# EAGLE design Pro-Mini-ICSP-FTDI (EAGLE 7.7.0)
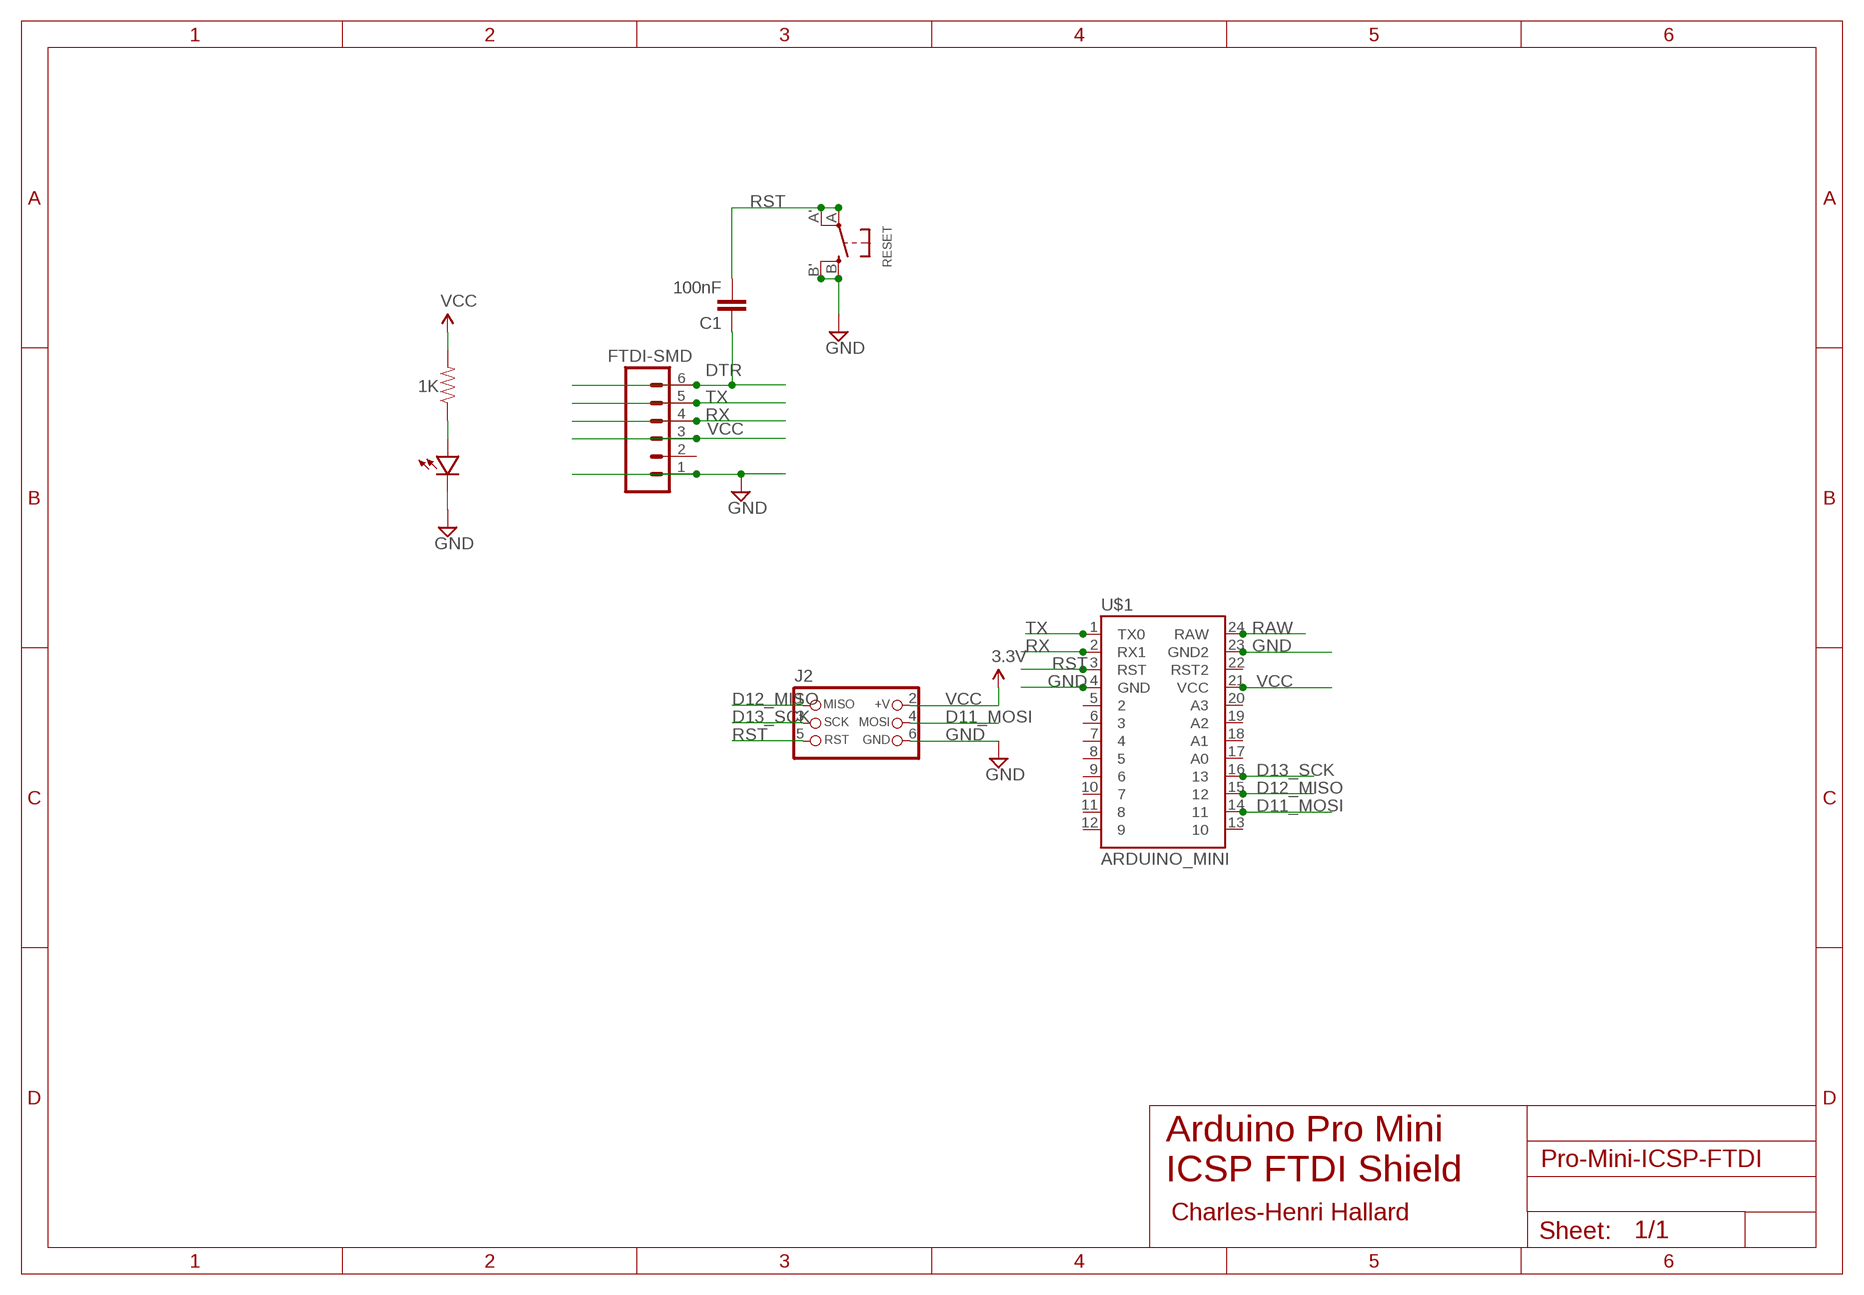
[diagram p0: schematic, sheet 1]

## Parts
C1  100nF  CAP0805-CAP  [0805-CAP]
FTDI-SMD  SMD  M06SIP  [1X06]
J2  CON_HEADER_PRG_AVR_ICSP-PTH  [HEADER_PRG_2X03]
R1  1K  RESISTOR0805-RES  [0805-RES]
RESET  SWITCH_TACT_SMT  [EVQ-Q2]
U$1  ARDUINO_MINI  [ARDUINO_MINI]
U$2  LED0805  [0805-LED]

## Nets
D11_MOSI: J2.4(MOSI) U$1.14
D12_MISO: J2.1(MISO) U$1.15
D13_SCK: J2.3(SCK) U$1.16
DTR: C1.1 FTDI-SMD.6
GND [power]: FTDI-SMD.1 J2.6(GND) RESET.B'(S1) RESET.B(S) U$1.4(GND) U$1.23(GND2) U$2.MINUS
N$2: R1.1 U$2.PLUS
RAW: U$1.24(RAW)
RST: C1.2 J2.5(RST) RESET.A'(P1) RESET.A(P) U$1.3(RST)
RX: FTDI-SMD.4 U$1.2(RX1)
TX: FTDI-SMD.5 U$1.1(TX0)
VCC: FTDI-SMD.3 J2.2(+V) R1.2 U$1.21(VCC) ; supply symbol labelled 3.3V
Unconnected: FTDI-SMD.2 U$1.5 U$1.6 U$1.7 U$1.8 U$1.9 U$1.10 U$1.11 U$1.12 U$1.13 U$1.17(A0) U$1.18(A1) U$1.19(A2) U$1.20(A3) U$1.22(RST2)

## Notes on the sheet
- Arduino Pro Mini
  ICSP FTDI Shield
- Charles-Henri Hallard

## Library data of the parts
C1 = _c2h:CAP: Capacitor Standard 0603 ceramic capacitor, and 0.1" leaded capacitor.
FTDI-SMD = SparkFun-Connectors:M06: Header 6 Standard 6-pin 0.1" header. Use with straight break away headers (SKU : PRT-00116), right angle break away headers (PRT-00553), swiss pins (PRT-00743), machine pins (PRT-00117), and female headers (PRT-00115). Molex polarized connector foot print use with SKU : PRT-08094 with associated crimp pins and housings. NOTES ON THE VARIANTS LOCK and LOCK_LONGPADS... This footprint was designed to help hold the alignment of a through-hole component (i.e. 6-pin header) while soldering it into place. You may notice that each hole has been shifted either up or down by 0.005 of an inch from it's more standard position (which is a perfectly straight line). This slight alteration caused the pins (the squares in the middle) to touch the edges of the holes. Because they are alternating, it causes a "brace" to hold the component in place. 0.005 has proven to be the perfect amount of "off-center" position when using our standard breakaway headers. Although looks a little odd when you look at the bare footprint, once you have a header in there, the alteration is very hard to notice. Also, if you push a header all the way into place, it is covered up entirely on the bottom side. This idea of altering the position of holes to aid alignment will be further integrated into the Sparkfun Library for other footprints. It can help hold any component with 3 or more connection pins.
J2 = dp_devices:CON_HEADER_PRG_AVR_ICSP: 2x3 AVR ICSP programming header
R1 = _c2h:RESISTOR: Resistor Basic schematic elements and footprints for 0603, 1206, and PTH resistors.
RESET = microbuilder:SWITCH_TACT_SMT: SMT Tact Switches 6x6mm - Digikey: P12940SCT-ND KMR2 (4.6x2.8mm) - Digikey: 401-1426-1-ND EVQ-PQHB55 - Light Touch, 160GF (4.5x4.5mm) - Digikey: P8090SCT-ND
U$1 = _c2h:ARDUINO_MINI: Arduino Pro Mini footprint
U$2 = LowPowerLab:LED

## Net classes
1 power: width 0.381 mm, clearance 0.254 mm

## Board
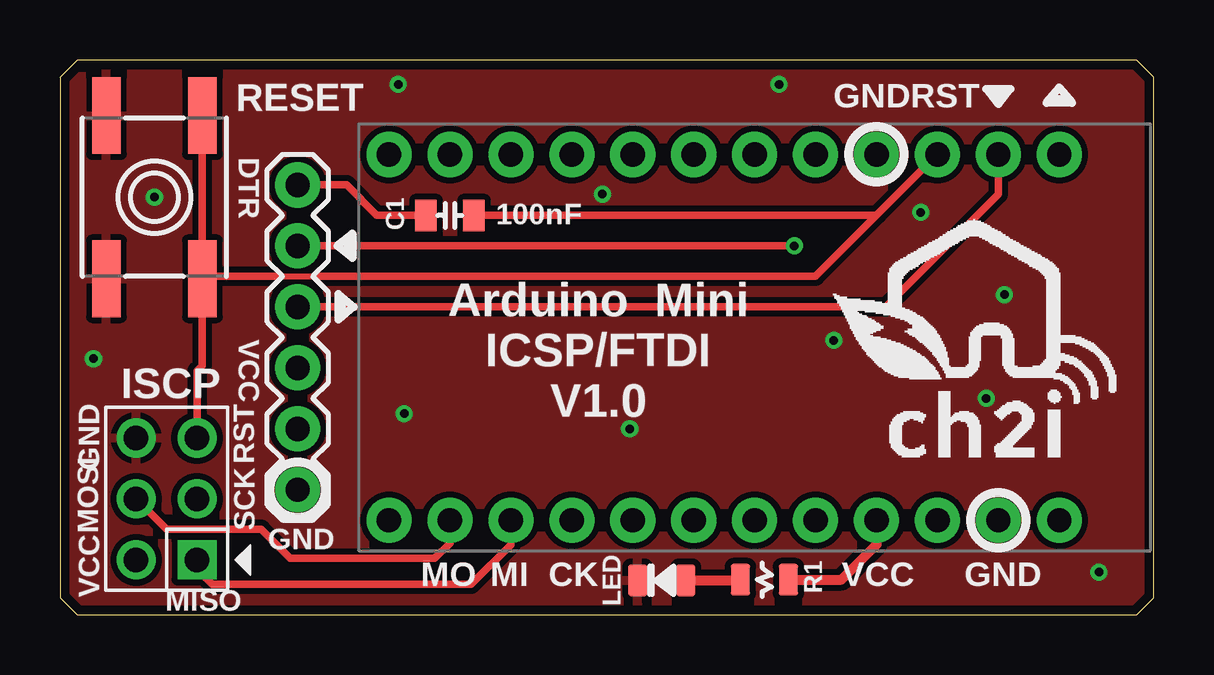
[diagram p1: board, top side]
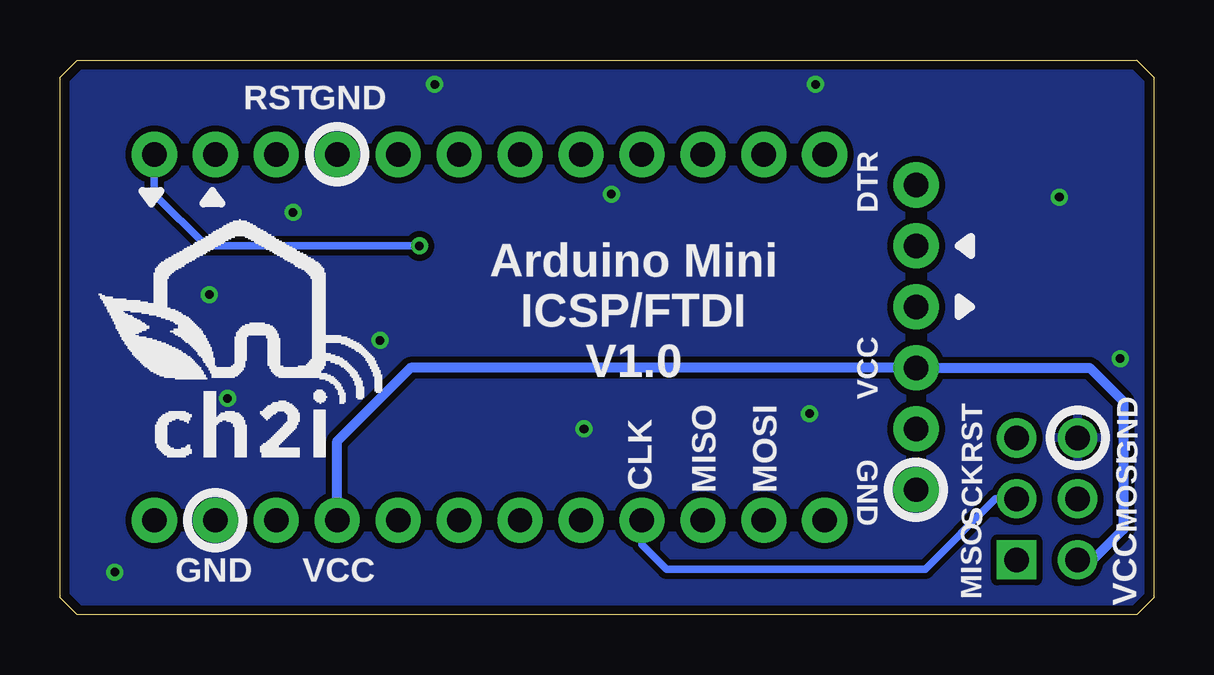
[diagram p2: board, bottom side, seen from below]

Size 45.59 x 23.11 mm. Coordinates in mm from the lower left corner, seen from the top.
Outline: 0.71,0 44.88,0 45.59,0.71 45.59,22.4 44.88,23.11 0.71,23.11 0,22.4 0,0.71 0.71,0
Copper layers (1*16): Top 0.0356mm / dielectric 1.5011mm / Bottom 0.0356mm
Design rules "PCBs_io": minimum track width 6mil, minimum drill 13mil, track to track 6mil, track to pad 6mil, pad to pad 6mil, via to via 6mil, smd to smd 6mil, copper to edge 15mil, drill to drill 6mil, minimum pad ring 7mil, minimum via ring 7mil, stop-mask expansion 3mil, vias tented up to drill 40mil, thermal gap 10mil

### Footprints (pad centres in the part's own frame; a part is rotated, then mirrored left to right if it is on the bottom)
0805-CAP = smd 0.902 x 1.3: 1 -1,0; 2 1,0
1X06 = drill 1.016 pad 1.88: 1 0,0; 2 2.54,0; 3 5.08,0; 4 7.62,0; 5 10.16,0; 6 12.7,0
HEADER_PRG_2X03 = drill 1.02 pad 1.632 square: 1 -2.54,-1.27 | drill 1.02 pad 1.632: 2 -2.54,1.27; 3 0,-1.27; 4 0,1.27; 5 2.54,-1.27; 6 2.54,1.27
0805-RES = smd 0.8 x 1.3: 1 -1,0; 2 1,0
EVQ-Q2 = smd 3.2 x 1.2: A -3.4,-2; A' 3.4,-2; B -3.4,2; B' 3.4,2
ARDUINO_MINI = drill 1.016 pad 1.88: 1 -7.62,12.7; 2 -7.62,10.16; 3 -7.62,7.62; 4 -7.62,5.08; 5 -7.62,2.54; 6 -7.62,0; 7 -7.62,-2.54; 8 -7.62,-5.08; 9 -7.62,-7.62; 10 -7.62,-10.16; 11 -7.62,-12.7; 12 -7.62,-15.24; 13 7.62,-15.24; 14 7.62,-12.7; 15 7.62,-10.16; 16 7.62,-7.62; 17 7.62,-5.08; 18 7.62,-2.54; 19 7.62,0; 20 7.62,2.54; 21 7.62,5.08; 22 7.62,7.62; 23 7.62,10.16; 24 7.62,12.7
0805-LED = smd 0.8 x 1.3: MINUS -1,0; PLUS 1,0

### Placement (x,y rotation side)
C1  16.26,16.64 0 top
FTDI-SMD  9.91,5.21 90 top
J2  4.45,4.83 90 top
R1  29.36,1.46 0 top
RESET  3.94,17.4 90 top
U$1  28.96,11.56 270 top
U$2  25.08,1.43 0 top
U$3  [LOGO_CH2I_110MM]  38.73,9.53 0 top
U$4  [LOGO_CH2I_110MM]  37.47,9.53 0 bottom

### Tracks (layer width: path | path; a pad name or v marks a point on that pad's centre or on a via)
D11_MOSI
  Top 0.305: J2.4 4.45,3.56 8.38,3.56 9.59,2.35 15.62,2.35 16.26,2.98 U$1.14
D12_MISO
  Top 0.305: U$1.15 18.8,2.92 17.14,1.27 6.35,1.27 5.71,1.91 J2.1
D13_SCK
  Bottom 0.305: U$1.16 21.34,2.92 20.32,1.91 9.53,1.91 6.6,4.83 J2.3
DTR
  Top 0.305: FTDI-SMD.6 11.94,17.91 13.21,16.64 C1.1
GND  (via drill 0.36 pad 0.71)
  other vias: 14.1,22.1 35.88,16.76 39.37,13.34 38.61,9.02 14.35,8.38 22.61,17.53 32.26,11.43 23.75,7.75 3.94,17.4 43.31,1.78 29.97,22.1 1.4,10.67
  pour Bottom (isolate 0.254): -0.89,24 -0.89,-0.76 46.35,-0.76 46.35,24
  pour Top (isolate 0.254): -0.38,24.64 -0.38,-1.4 46.99,-1.4 46.99,24.64
N$2
  Top 0.406: U$2.PLUS 28.36,1.43 R1.1
RST
  Top 0.254: 9.21,14.1 10.6,14.1
  Top 0.305: 10.6,14.1 31.5,14.1 34.04,16.64 | J2.5 5.71,10.16 5.94,10.38 RESET.A | RESET.A' RESET.A | 9.21,14.1 6.04,14.1 RESET.A | U$1.3 34.1,16.7 34.04,16.64 | C1.2 34.04,16.64
RX
  Top 0.305: FTDI-SMD.4 34.42,12.83 39.12,17.53 U$1.2
TX  (via drill 0.36 pad 0.71)
  Top 0.305: FTDI-SMD.5 v30.61,15.37
  Bottom 0.305: U$1.1 41.66,17.53 39.5,15.37 v30.61,15.37
VCC
  Top 0.406: R1.2 32.58,1.46 34.04,2.92 U$1.21
  Bottom 0.406: U$1.21 34.04,7.24 30.99,10.29 FTDI-SMD.3 2.67,10.29 1.27,8.89 1.27,3.56 2.54,2.29 J2.2

### Text on the board
tNames: GND | RST | DTR | Arduino Mini / ICSP/FTDI / V1.0 | ISCP | VCC | GND | SCK | RST | VCC | MOSI | GND | LED | MO | MI | CK | R1 | VCC | GND | MISO
bNames: GND | RST | DTR | Arduino Mini / ICSP/FTDI / V1.0 | VCC | MOSI | MISO | CLK | GND | RST | GND | SCK | MOSI | VCC | VCC | GND | MISO